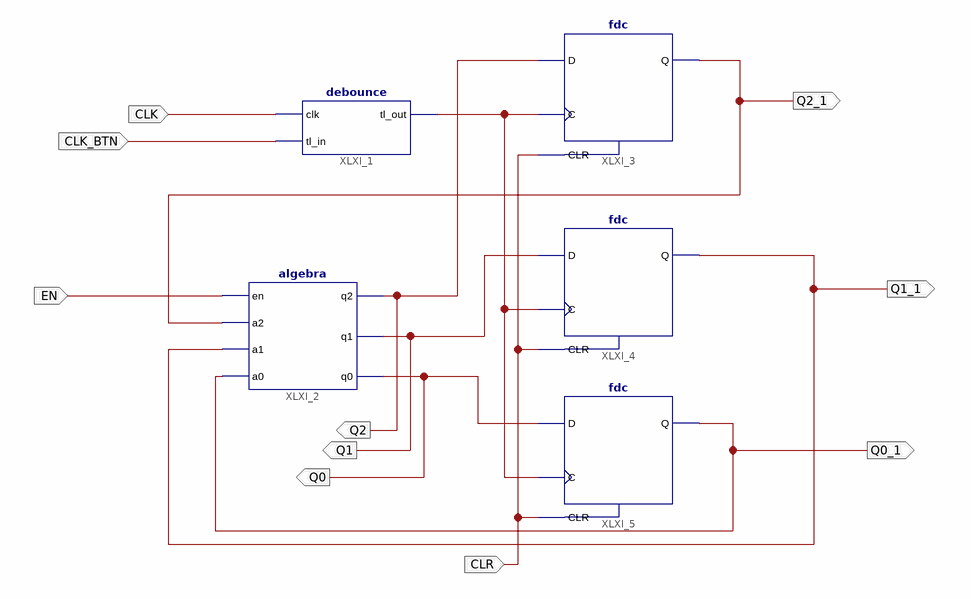
[diagram p0: schematic sheet 1]
// Xilinx ISE schematic modulo6.sch (spartan3e) as structural Verilog: 5 symbols, 10 ports
module modulo6 (
  input  EN,
  input  CLR,
  input  CLK,
  input  CLK_BTN,
  output Q2,
  output Q1,
  output Q0,
  output Q2_1,
  output Q1_1,
  output Q0_1
);

  wire XLXN_8;

  fdc XLXI_4 (.C(XLXN_8), .CLR(CLR), .D(Q1), .Q(Q1_1));
  algebra XLXI_2 (.en(EN), .a2(Q2_1), .a1(Q1_1), .a0(Q0_1), .q2(Q2), .q1(Q1), .q0(Q0));
  fdc XLXI_3 (.C(XLXN_8), .CLR(CLR), .D(Q2), .Q(Q2_1));
  fdc XLXI_5 (.C(XLXN_8), .CLR(CLR), .D(Q0), .Q(Q0_1));
  debounce XLXI_1 (.clk(CLK), .tl_in(CLK_BTN), .tl_out(XLXN_8));
endmodule
